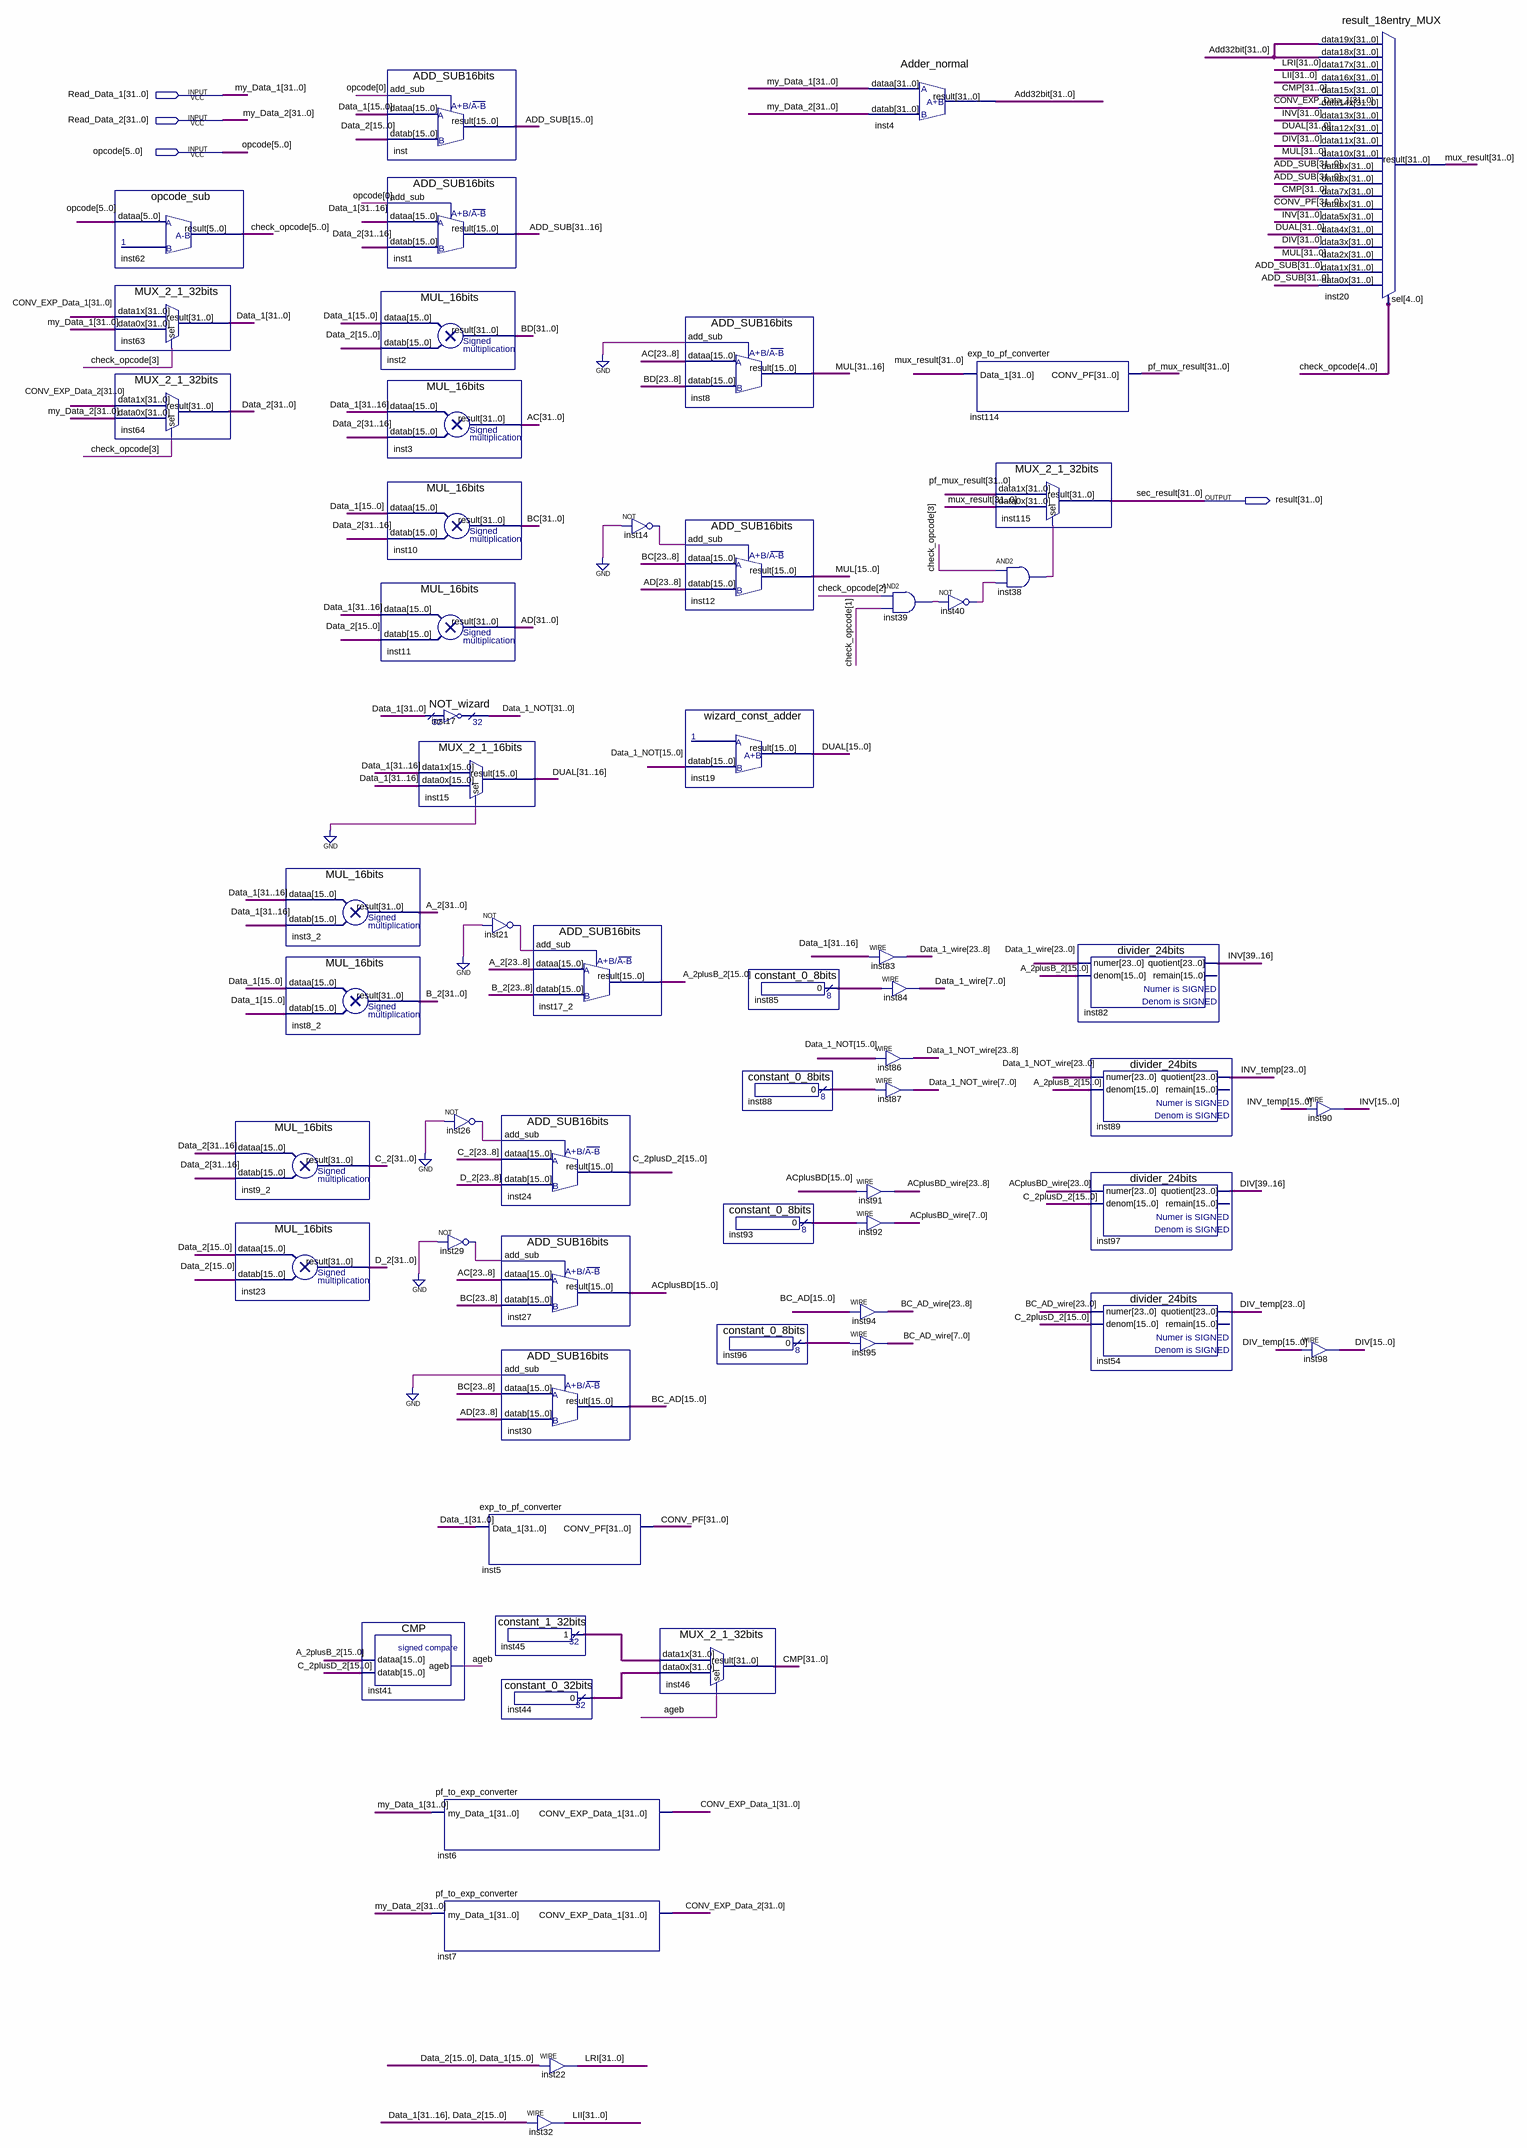
[diagram p0: schematic sheet]
// Quartus schematic CO_P_ALU.bdf as structural Verilog: 60 symbols, 4 pins
module CO_P_ALU (
  input  [31:0] Read_Data_1,
  input  [31:0] Read_Data_2,
  input  [5:0] opcode,
  output [31:0] result
);

  wire ageb, inst14_out, inst21_out, inst26_out, inst29_out, inst38_out, inst39_out, inst40_out;
  wire [5:0] check_opcode;
  wire [7:0] inst85_result, inst88_result, inst93_result, inst96_result;
  wire [15:0] A_2plusB_2, ACplusBD, BC_AD, C_2plusD_2;
  wire [23:0] ACplusBD_wire, BC_AD_wire, Data_1_NOT_wire, Data_1_wire, DIV_temp, INV_temp;
  wire [31:0] A_2, AC, AD, Add32bit, ADD_SUB, B_2, BC, BD, C_2, CMP, CONV_EXP_Data_1, CONV_EXP_Data_2,
       CONV_PF, D_2, Data_1, Data_1_NOT, Data_2, DUAL, inst44_result, inst45_result, LII, LRI, MUL,
       mux_result, pf_mux_result;
  wire [39:0] DIV, INV;

  opcode_sub inst62 (.dataa(opcode), .result(check_opcode));
  MUX_2_1_32bits inst63 (.data1x(CONV_EXP_Data_1), .data0x(Read_Data_1), .sel(check_opcode[3]), .result(Data_1));
  MUX_2_1_32bits inst64 (.data1x(CONV_EXP_Data_2), .data0x(Read_Data_2), .sel(check_opcode[3]), .result(Data_2));
  MUL_16bits inst9_2 (.dataa(Data_2[31:16]), .datab(Data_2[31:16]), .result(C_2));
  MUL_16bits inst23 (.dataa(Data_2[15:0]), .datab(Data_2[15:0]), .result(D_2));
  MUL_16bits inst3_2 (.dataa(Data_1[31:16]), .datab(Data_1[31:16]), .result(A_2));
  MUL_16bits inst8_2 (.dataa(Data_1[15:0]), .datab(Data_1[15:0]), .result(B_2));
  ADD_SUB16bits inst (.add_sub(opcode[0]), .dataa(Data_1[15:0]), .datab(Data_2[15:0]), .result(ADD_SUB[15:0]));
  ADD_SUB16bits inst1 (.add_sub(opcode[0]), .dataa(Data_1[31:16]), .datab(Data_2[31:16]), .result(ADD_SUB[31:16]));
  MUL_16bits inst2 (.dataa(Data_1[15:0]), .datab(Data_2[15:0]), .result(BD));
  MUL_16bits inst3 (.dataa(Data_1[31:16]), .datab(Data_2[31:16]), .result(AC));
  MUL_16bits inst10 (.dataa(Data_1[15:0]), .datab(Data_2[31:16]), .result(BC));
  MUL_16bits inst11 (.dataa(Data_1[31:16]), .datab(Data_2[15:0]), .result(AD));
  CMP inst41 (.dataa(A_2plusB_2), .datab(C_2plusD_2), .ageb(ageb));
  NOT_wizard inst17 (.data(Data_1), .result(Data_1_NOT));
  MUX_2_1_16bits inst15 (.data1x(Data_1[31:16]), .data0x(Data_1[31:16]), .sel(1'b0), .result(DUAL[31:16]));
  not inst26 (inst26_out, 1'b0);
  not inst29 (inst29_out, 1'b0);
  pf_to_exp_converter inst6 (.my_Data_1(Read_Data_1), .CONV_EXP_Data_1(CONV_EXP_Data_1));
  pf_to_exp_converter inst7 (.my_Data_1(Read_Data_2), .CONV_EXP_Data_1(CONV_EXP_Data_2));
  not inst21 (inst21_out, 1'b0);
  exp_to_pf_converter inst5 (.Data_1(Data_1), .CONV_PF(CONV_PF));
  constant_1_32bits inst45 (.result(inst45_result));
  ADD_SUB16bits inst17_2 (.add_sub(inst21_out), .dataa(A_2[23:8]), .datab(B_2[23:8]), .result(A_2plusB_2));
  ADD_SUB16bits inst24 (.add_sub(inst26_out), .dataa(C_2[23:8]), .datab(D_2[23:8]), .result(C_2plusD_2));
  ADD_SUB16bits inst27 (.add_sub(inst29_out), .dataa(AC[23:8]), .datab(BC[23:8]), .result(ACplusBD));
  ADD_SUB16bits inst30 (.add_sub(1'b0), .dataa(BC[23:8]), .datab(AD[23:8]), .result(BC_AD));
  constant_0_32bits inst44 (.result(inst44_result));
  assign LRI = {Data_2[15:0], Data_1[15:0]};  // WIRE inst22
  assign LII = {Data_1[31:16], Data_2[15:0]};  // WIRE inst32
  not inst14 (inst14_out, 1'b0);
  ADD_SUB16bits inst8 (.add_sub(1'b0), .dataa(AC[23:8]), .datab(BD[23:8]), .result(MUL[31:16]));
  ADD_SUB16bits inst12 (.add_sub(inst14_out), .dataa(BC[23:8]), .datab(AD[23:8]), .result(MUL[15:0]));
  wizard_const_adder inst19 (.datab(Data_1_NOT[15:0]), .result(DUAL[15:0]));
  MUX_2_1_32bits inst46 (.data1x(inst45_result), .data0x(inst44_result), .sel(ageb), .result(CMP));
  constant_0_8bits inst85 (.result(inst85_result));
  constant_0_8bits inst88 (.result(inst88_result));
  constant_0_8bits inst93 (.result(inst93_result));
  constant_0_8bits inst96 (.result(inst96_result));
  assign BC_AD_wire[23:8] = BC_AD;  // WIRE inst94
  assign BC_AD_wire[7:0] = inst96_result;  // WIRE inst95
  Adder_normal inst4 (.dataa(Read_Data_1), .datab(Read_Data_2), .result(Add32bit));
  and inst39 (inst39_out, check_opcode[2], check_opcode[1]);
  assign Data_1_wire[23:8] = Data_1[31:16];  // WIRE inst83
  assign Data_1_wire[7:0] = inst85_result;  // WIRE inst84
  assign Data_1_NOT_wire[23:8] = Data_1_NOT[15:0];  // WIRE inst86
  assign Data_1_NOT_wire[7:0] = inst88_result;  // WIRE inst87
  assign ACplusBD_wire[23:8] = ACplusBD;  // WIRE inst91
  assign ACplusBD_wire[7:0] = inst93_result;  // WIRE inst92
  not inst40 (inst40_out, inst39_out);
  exp_to_pf_converter inst114 (.Data_1(mux_result), .CONV_PF(pf_mux_result));
  MUX_2_1_32bits inst115 (.data1x(pf_mux_result), .data0x(mux_result), .sel(inst38_out), .result(result));
  and inst38 (inst38_out, check_opcode[3], inst40_out);
  divider_24bits inst82 (.numer(Data_1_wire), .denom(A_2plusB_2), .quotient(INV[39:16]));  // open: remain
  divider_24bits inst89 (.numer(Data_1_NOT_wire), .denom(A_2plusB_2), .quotient(INV_temp));  // open: remain
  divider_24bits inst97 (.numer(ACplusBD_wire), .denom(C_2plusD_2), .quotient(DIV[39:16]));  // open: remain
  divider_24bits inst54 (.numer(BC_AD_wire), .denom(C_2plusD_2), .quotient(DIV_temp));  // open: remain
  assign INV[15:0] = INV_temp[15:0];  // WIRE inst90
  assign DIV[15:0] = DIV_temp[15:0];  // WIRE inst98
  result_18entry_MUX inst20 (
    .data19x(Add32bit), .data18x(Add32bit), .data17x(LRI), .data16x(LII), .data15x(CMP),
    .data14x(CONV_EXP_Data_1), .data13x(INV[31:0]), .data12x(DUAL), .data11x(DIV[31:0]), .data10x(MUL),
    .data9x(ADD_SUB), .data8x(ADD_SUB), .data7x(CMP), .data6x(CONV_PF), .data5x(INV[31:0]), .data4x(DUAL),
    .data3x(DIV[31:0]), .data2x(MUL), .data1x(ADD_SUB), .data0x(ADD_SUB), .sel(check_opcode[4:0]),
    .result(mux_result));

  // Other names for the same wires on the sheet: my_Data_1[31:0] = Read_Data_1; my_Data_2[31:0] = Read_Data_2;
  //   sec_result[31:0] = result
endmodule
